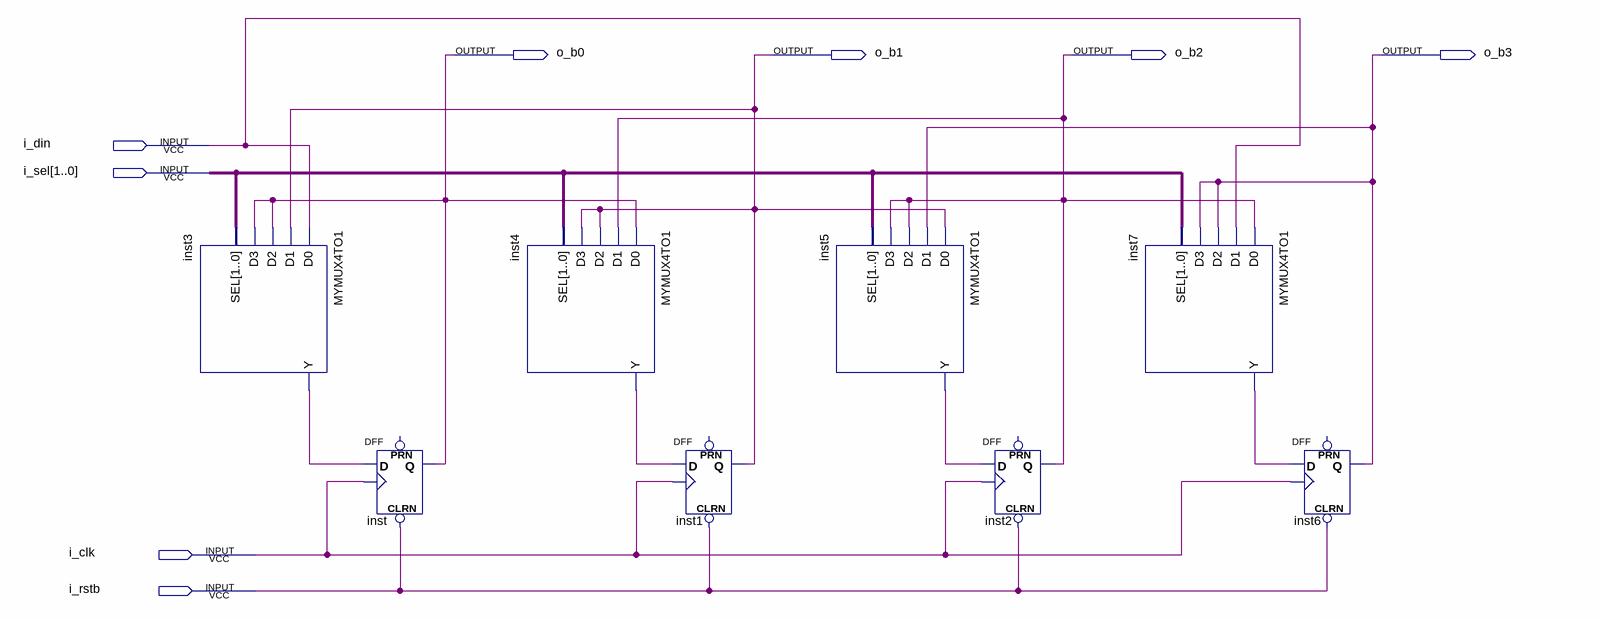
[diagram p0: schematic sheet]
// Quartus schematic shift_reg_4bit.bdf as structural Verilog: 8 symbols, 8 pins
module shift_reg_4bit (
  input  i_din,
  input  [1:0] i_sel,
  input  i_clk,
  input  i_rstb,
  output o_b0,
  output o_b1,
  output o_b2,
  output o_b3
);

  wire inst3_y, inst4_y, inst5_y, inst7_y;

  MYMUX4TO1 inst3 (.D0(i_din), .D1(o_b1), .D2(o_b0), .D3(o_b0), .SEL(i_sel), .Y(inst3_y));
  DFF inst (.CLRN(i_rstb), .CLK(i_clk), .D(inst3_y), .Q(o_b0));  // open: PRN
  MYMUX4TO1 inst4 (.D0(o_b0), .D1(o_b2), .D2(o_b1), .D3(o_b1), .SEL(i_sel), .Y(inst4_y));
  DFF inst1 (.CLRN(i_rstb), .CLK(i_clk), .D(inst4_y), .Q(o_b1));  // open: PRN
  MYMUX4TO1 inst5 (.D0(o_b1), .D1(o_b3), .D2(o_b2), .D3(o_b2), .SEL(i_sel), .Y(inst5_y));
  DFF inst2 (.CLRN(i_rstb), .CLK(i_clk), .D(inst5_y), .Q(o_b2));  // open: PRN
  MYMUX4TO1 inst7 (.D0(o_b2), .D1(i_din), .D2(o_b3), .D3(o_b3), .SEL(i_sel), .Y(inst7_y));
  DFF inst6 (.CLRN(i_rstb), .CLK(i_clk), .D(inst7_y), .Q(o_b3));  // open: PRN
endmodule
